# EAGLE design M837-pld-84 (EAGLE 6.6.0)
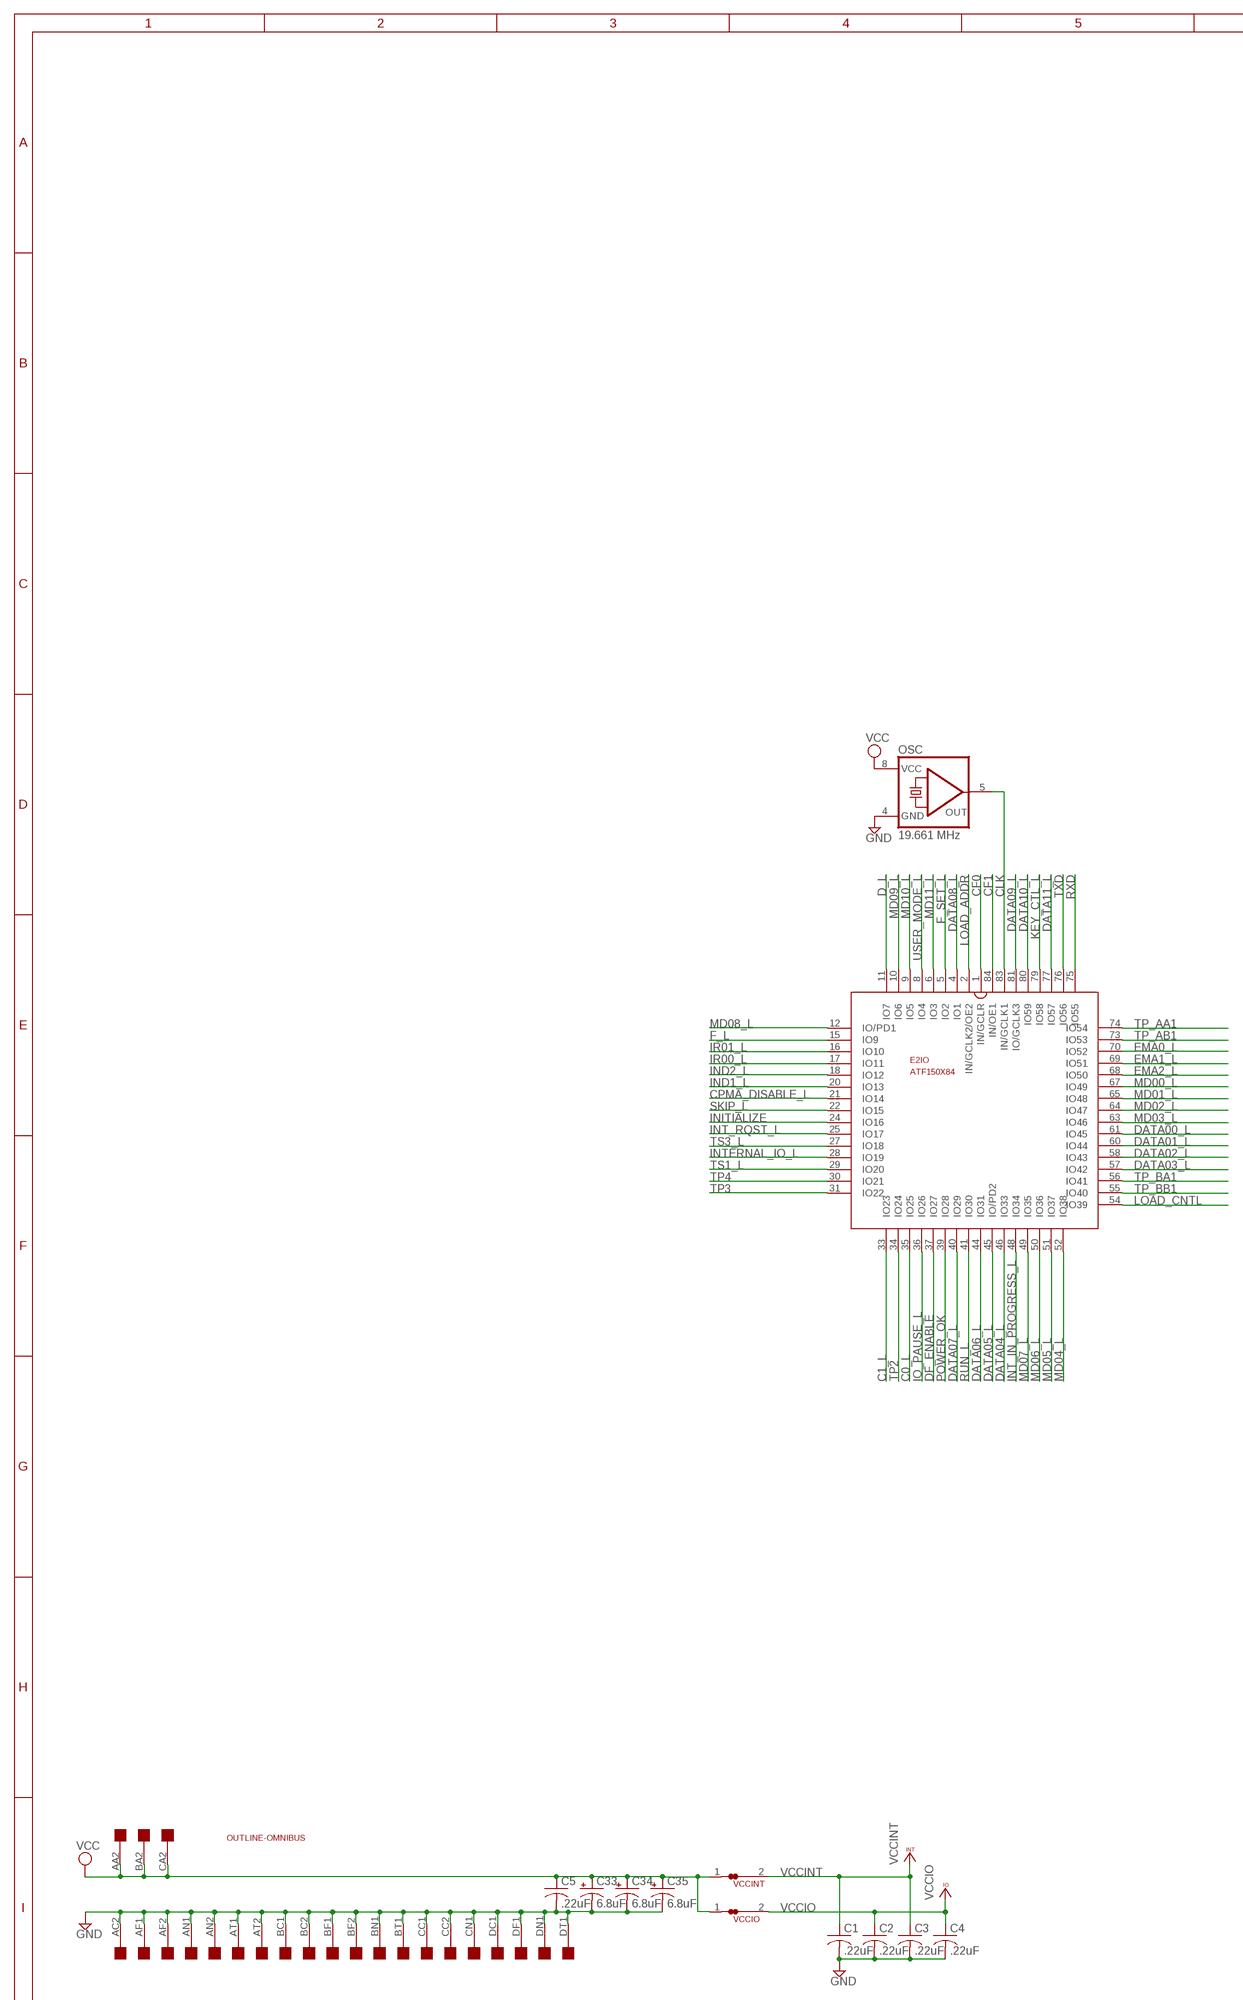
[diagram p0: schematic, sheet 1, part 1 of 2]
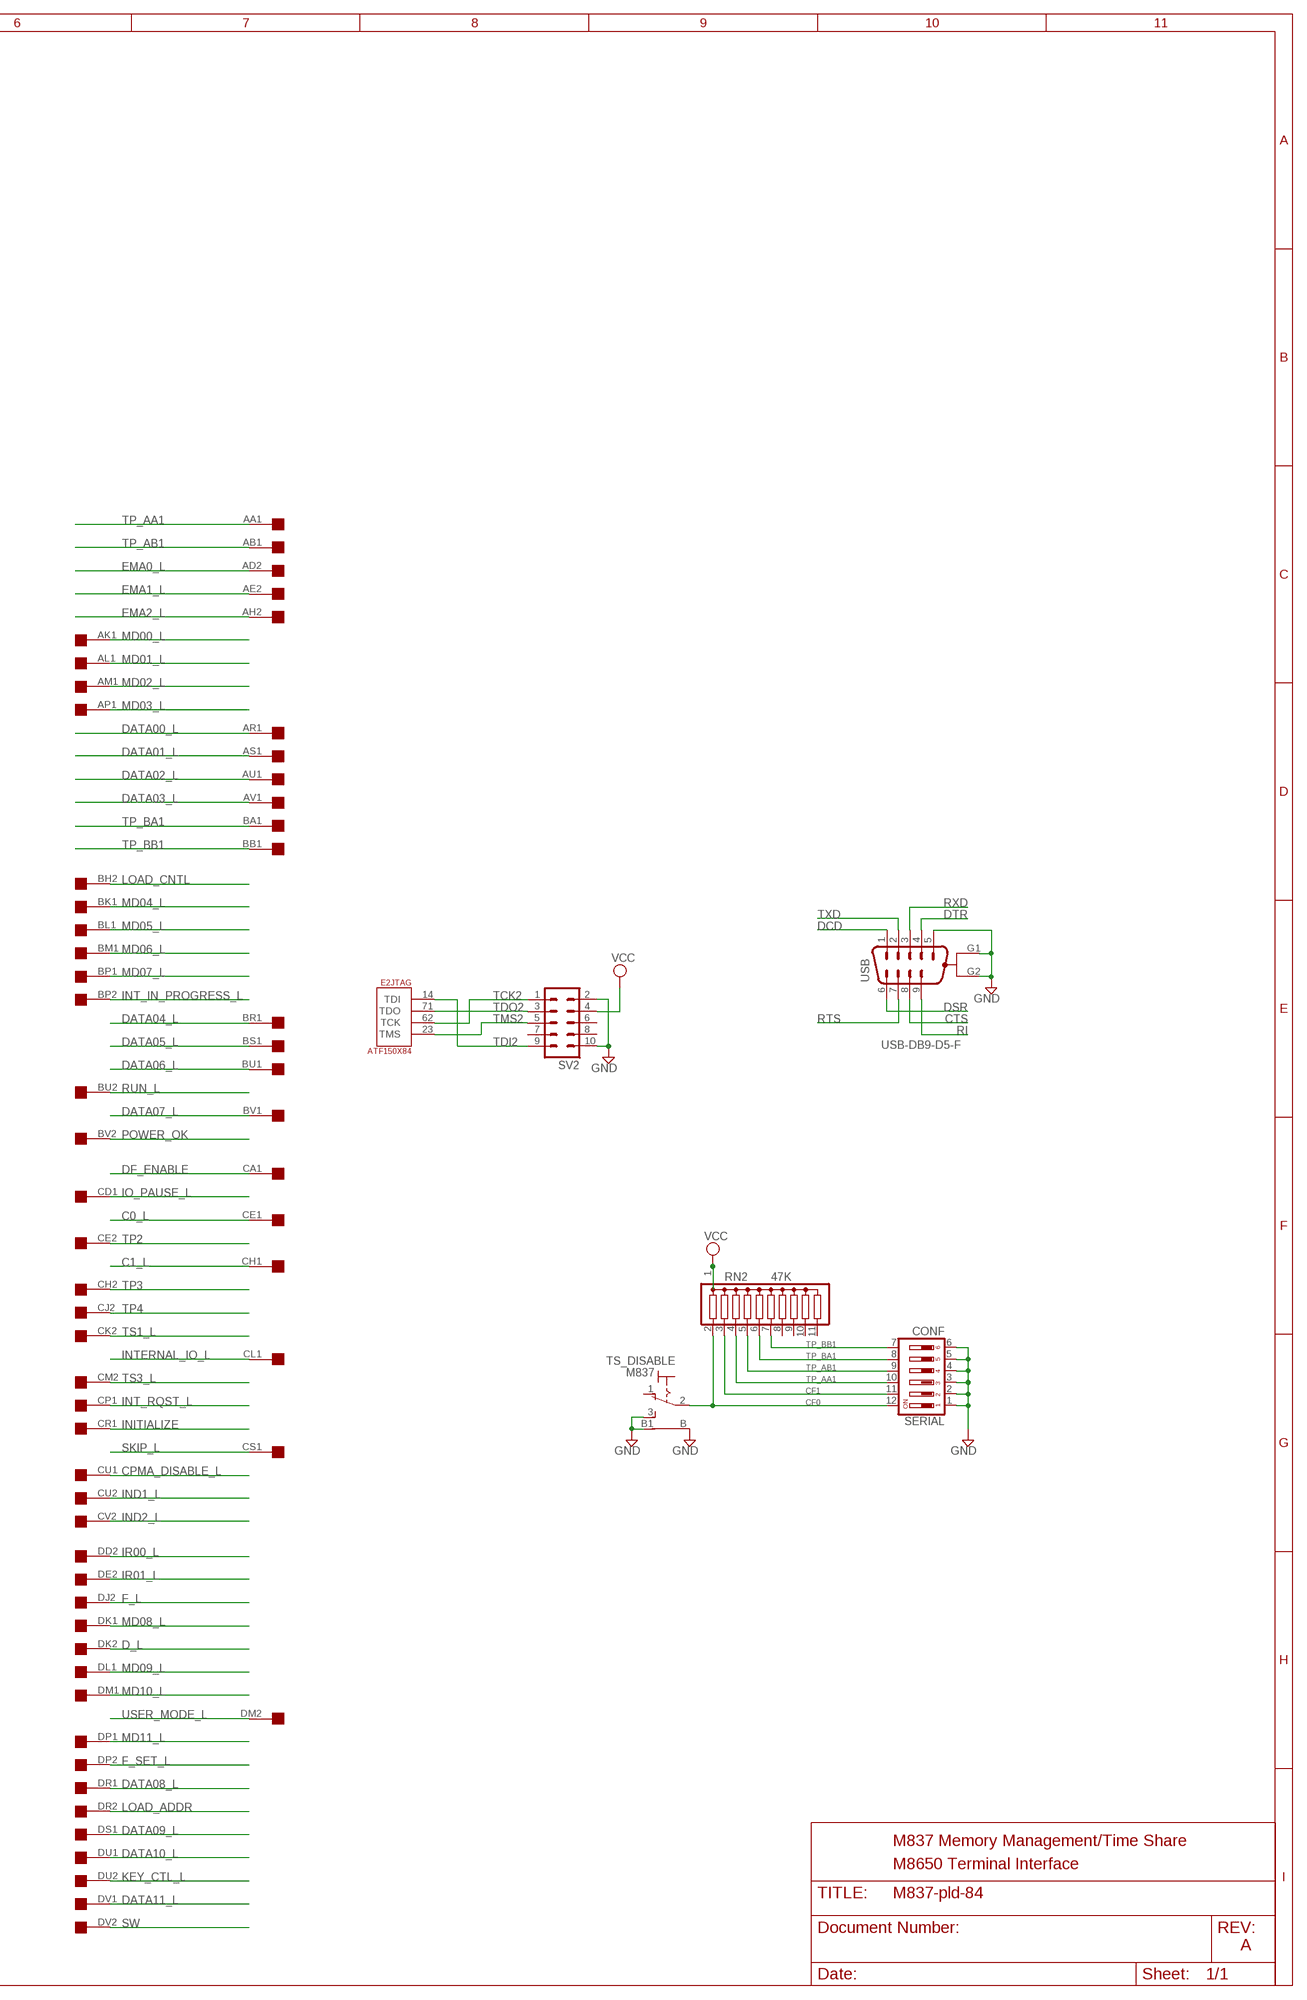
[diagram p1: schematic, sheet 1, part 2 of 2]

## Parts
C1  .22uF  C-US  [C063-025X075]
C2  .22uF  C-US  [C063-025X075]
C3  .22uF  C-US  [C063-025X075]
C4  .22uF  C-US  [C063-025X075]
C5  .22uF  C-US  [C063-025X075]
C33  6.8uF  CPOL-USE20-8AXIAL  [E12-8]
C34  6.8uF  CPOL-USE20-8AXIAL  [E12-8]
C35  6.8uF  CPOL-USE20-8AXIAL  [E12-8]
E2  ATF150X84  [S84]
OSC  19.661 MHz  QG5460  [DIL08S]
RN2  47K  G10R  [SIL11]
SERIAL  CONF  DP06  [DP-06]
SV2  ML10  [ML10]
TS_DISABLE  M837  9070-1W  [9070-1W]
U$1  QUAD  [EDGE-CON8]
U$2  OUTLINE-OMNIBUS  [OMNIBUS]
USB  USB-DB9-D5-F  DB9  [AMP_DB-9RA]
VCCINT  JUMPER-NC1  [NC1]
VCCIO  JUMPER-NC1  [NC1]

## Nets
C0_L: E2.35(IO:IO25) U$1.CE1
C1_L: E2.33(IO:IO23) U$1.CH1
CF0: E2.1(IO:IN/GCLR) RN2.2 SERIAL.12 TS_DISABLE.2(P)
CF1: E2.84(IO:IN/OE1) RN2.3 SERIAL.11
CLK: E2.83(IO:IN/GCLK1) OSC.5(OUT)
CPMA_DISABLE_L: E2.21(IO:IO14) U$1.CU1
CTS: USB.8
D_L: E2.11(IO:IO7) U$1.DK2
DATA00_L: E2.61(IO:IO45) U$1.AR1
DATA01_L: E2.60(IO:IO44) U$1.AS1
DATA02_L: E2.58(IO:IO43) U$1.AU1
DATA03_L: E2.57(IO:IO42) U$1.AV1
DATA04_L: E2.46(IO:IO33) U$1.BR1
DATA05_L: E2.45(IO:IO/PD2) U$1.BS1
DATA06_L: E2.44(IO:IO31) U$1.BU1
DATA07_L: E2.40(IO:IO29) U$1.BV1
DATA08_L: E2.4(IO:IO1) U$1.DR1
DATA09_L: E2.81(IO:IO/GCLK3) U$1.DS1
DATA10_L: E2.80(IO:IO59) U$1.DU1
DATA11_L: E2.77(IO:IO57) U$1.DV1
DCD: USB.1
DF_ENABLE: E2.37(IO:IO27) U$1.CA1
DSR: USB.6
DTR: USB.4
EMA0_L: E2.70(IO:IO52) U$1.AD2
EMA1_L: E2.69(IO:IO51) U$1.AE2
EMA2_L: E2.68(IO:IO50) U$1.AH2
F_L: E2.15(IO:IO9) U$1.DJ2
F_SET_L: E2.5(IO:IO2) U$1.DP2
GND [supply]: C1.2 C2.2 C3.2 C4.2 C5.2 C33.- C34.- C35.- OSC.4(GND) SERIAL.1 SERIAL.2 SERIAL.3 SERIAL.4 SERIAL.5 SERIAL.6 SV2.2 SV2.10 TS_DISABLE.3(S) TS_DISABLE.B TS_DISABLE.B1 U$1.AC2 U$1.AF1 U$1.AF2 U$1.AN1 U$1.AN2 U$1.AT1 U$1.AT2 U$1.BC1 U$1.BC2 U$1.BF1 U$1.BF2 U$1.BN1 U$1.BT1 U$1.CC1 U$1.CC2 U$1.CN1 U$1.DC1 U$1.DF1 U$1.DN1 U$1.DT1 USB.5 USB.G1 USB.G2
IND1_L: E2.20(IO:IO13) U$1.CU2
IND2_L: E2.18(IO:IO12) U$1.CV2
INITIALIZE: E2.24(IO:IO16) U$1.CR1
INT_IN_PROGRESS_L: E2.48(IO:IO34) U$1.BP2
INT_RQST_L: E2.25(IO:IO17) U$1.CP1
INTERNAL_IO_L: E2.28(IO:IO19) U$1.CL1
IO_PAUSE_L: E2.36(IO:IO26) U$1.CD1
IR00_L: E2.17(IO:IO11) U$1.DD2
IR01_L: E2.16(IO:IO10) U$1.DE2
KEY_CTL_L: E2.79(IO:IO58) U$1.DU2
LOAD_ADDR: E2.2(IO:IN/GCLK2/OE2) U$1.DR2
LOAD_CNTL: E2.54(IO:IO39) U$1.BH2
MD00_L: E2.67(IO:IO49) U$1.AK1
MD01_L: E2.65(IO:IO48) U$1.AL1
MD02_L: E2.64(IO:IO47) U$1.AM1
MD03_L: E2.63(IO:IO46) U$1.AP1
MD04_L: E2.52(IO:IO38) U$1.BK1
MD05_L: E2.51(IO:IO37) U$1.BL1
MD06_L: E2.50(IO:IO36) U$1.BM1
MD07_L: E2.49(IO:IO35) U$1.BP1
MD08_L: E2.12(IO:IO/PD1) U$1.DK1
MD09_L: E2.10(IO:IO6) U$1.DL1
MD10_L: E2.9(IO:IO5) U$1.DM1
MD11_L: E2.6(IO:IO3) U$1.DP1
POWER_OK: E2.39(IO:IO28) U$1.BV2
RI: USB.9
RTS: USB.7
RUN_L: E2.41(IO:IO30) U$1.BU2
RXD: E2.75(IO:IO55) USB.3
SKIP_L: E2.22(IO:IO15) U$1.CS1
SW: U$1.DV2
TCK2: E2.62(JTAG:TCK) SV2.1
TDI2: E2.14(JTAG:TDI) SV2.9
TDO2: E2.71(JTAG:TDO) SV2.3
TMS2: E2.23(JTAG:TMS) SV2.5
TP2: E2.34(IO:IO24) U$1.CE2
TP3: E2.31(IO:IO22) U$1.CH2
TP4: E2.30(IO:IO21) U$1.CJ2
TP_AA1: E2.74(IO:IO54) RN2.4 SERIAL.10 U$1.AA1
TP_AB1: E2.73(IO:IO53) RN2.5 SERIAL.9 U$1.AB1
TP_BA1: E2.56(IO:IO41) RN2.6 SERIAL.8 U$1.BA1
TP_BB1: E2.55(IO:IO40) RN2.7 SERIAL.7 U$1.BB1
TS1_L: E2.29(IO:IO20) U$1.CK2
TS3_L: E2.27(IO:IO18) U$1.CM2
TXD: E2.76(IO:IO56) USB.2
USER_MODE_L: E2.8(IO:IO4) U$1.DM2
VCC [supply]: C5.1 C33.+ C34.+ C35.+ OSC.8(VCC) RN2.1 SV2.4 U$1.AA2 U$1.BA2 U$1.CA2 VCCINT.1 VCCIO.1
VCCINT [supply]: C1.1 C3.1 VCCINT.2
VCCIO [supply]: C2.1 C4.1 VCCIO.2
Unconnected: RN2.8 RN2.9 RN2.10 RN2.11 SV2.6 SV2.7 SV2.8 TS_DISABLE.1(O) U$1.AB2 U$1.AC1 U$1.AD1 U$1.AE1 U$1.AH1 U$1.AJ1 U$1.AJ2 U$1.AK2 U$1.AL2 U$1.AM2 U$1.AP2 U$1.AR2 U$1.AS2 U$1.AU2 U$1.AV2 U$1.BB2 U$1.BD1 U$1.BD2 U$1.BE1 U$1.BE2 U$1.BH1 U$1.BJ1 U$1.BJ2 U$1.BK2 U$1.BL2 U$1.BM2 U$1.BN2 U$1.BR2 U$1.BS2 U$1.BT2 U$1.CB1 U$1.CB2 U$1.CD2 U$1.CF1 U$1.CF2 U$1.CJ1 U$1.CK1 U$1.CL2 U$1.CM1 U$1.CN2 U$1.CP2 U$1.CR2 U$1.CS2 U$1.CT1 U$1.CT2 U$1.CV1 U$1.DA1 U$1.DA2 U$1.DB1 U$1.DB2 U$1.DC2 U$1.DD1 U$1.DE1 U$1.DF2 U$1.DH1 U$1.DH2 U$1.DJ1 U$1.DL2 U$1.DN2 U$1.DS2 U$1.DT2

## Notes on the sheet
- M837 Memory Management/Time Share
- M8650 Terminal Interface
- A

## Power pins joined to a net without a drawn wire
GND: E2.7(GND) E2.19(GND) E2.32(GND) E2.42(GND) E2.47(GND) E2.59(GND) E2.72(GND) E2.82(GND)
VCCINT: E2.3(VCCINT) E2.43(VCCINT)
VCCIO: E2.13(VCCIO) E2.26(VCCIO) E2.38(VCCIO) E2.53(VCCIO) E2.66(VCCIO) E2.78(VCCIO)

## Library data of the parts
C1-C5 = dec-con:C-US: Capacitors with funky DEC lead spacing.
C33-C35 = dec-con:CPOL-USE20-8AXIAL: A 0.8 inch electrolytic.
E2 = atmel-cpld:ATF150X84: ATF150x in 84 pin package.
OSC = crystal:QG5460: CRYSTAL RESONATOR; OC_FARNELL: unknown; OC_NEWARK: unknown
RN2 = resistor-sil:G10R: SIL RESISTOR; OC_FARNELL: unknown; OC_NEWARK: unknown
SERIAL = switch-dil:DP06: DIL/CODE SWITCH; MPN: MCDP06; OC_FARNELL: 9471618; OC_NEWARK: 26M1097
SV2 = con-harting-ml:ML10: HARTING; OC_FARNELL: unknown; OC_NEWARK: unknown
TS_DISABLE = switch:9070-1W: TOGGLE SWITCH Marquardt
U$1 = dec-con:QUAD: Quad-Height DEC board
U$2 = dec-con:OUTLINE-*: Board outlines for DEC boards.
USB = alan_common:DB9; MANF: TE/AMP; MANF#: 1734352-1; MOUSER#: 571-1734352-1
VCCINT VCCIO = dec-con:JUMPER: Normally closed SMD Jumper (Generates a DRC error.)

## Net classes
1 supply: width 0.381 mm

## Board
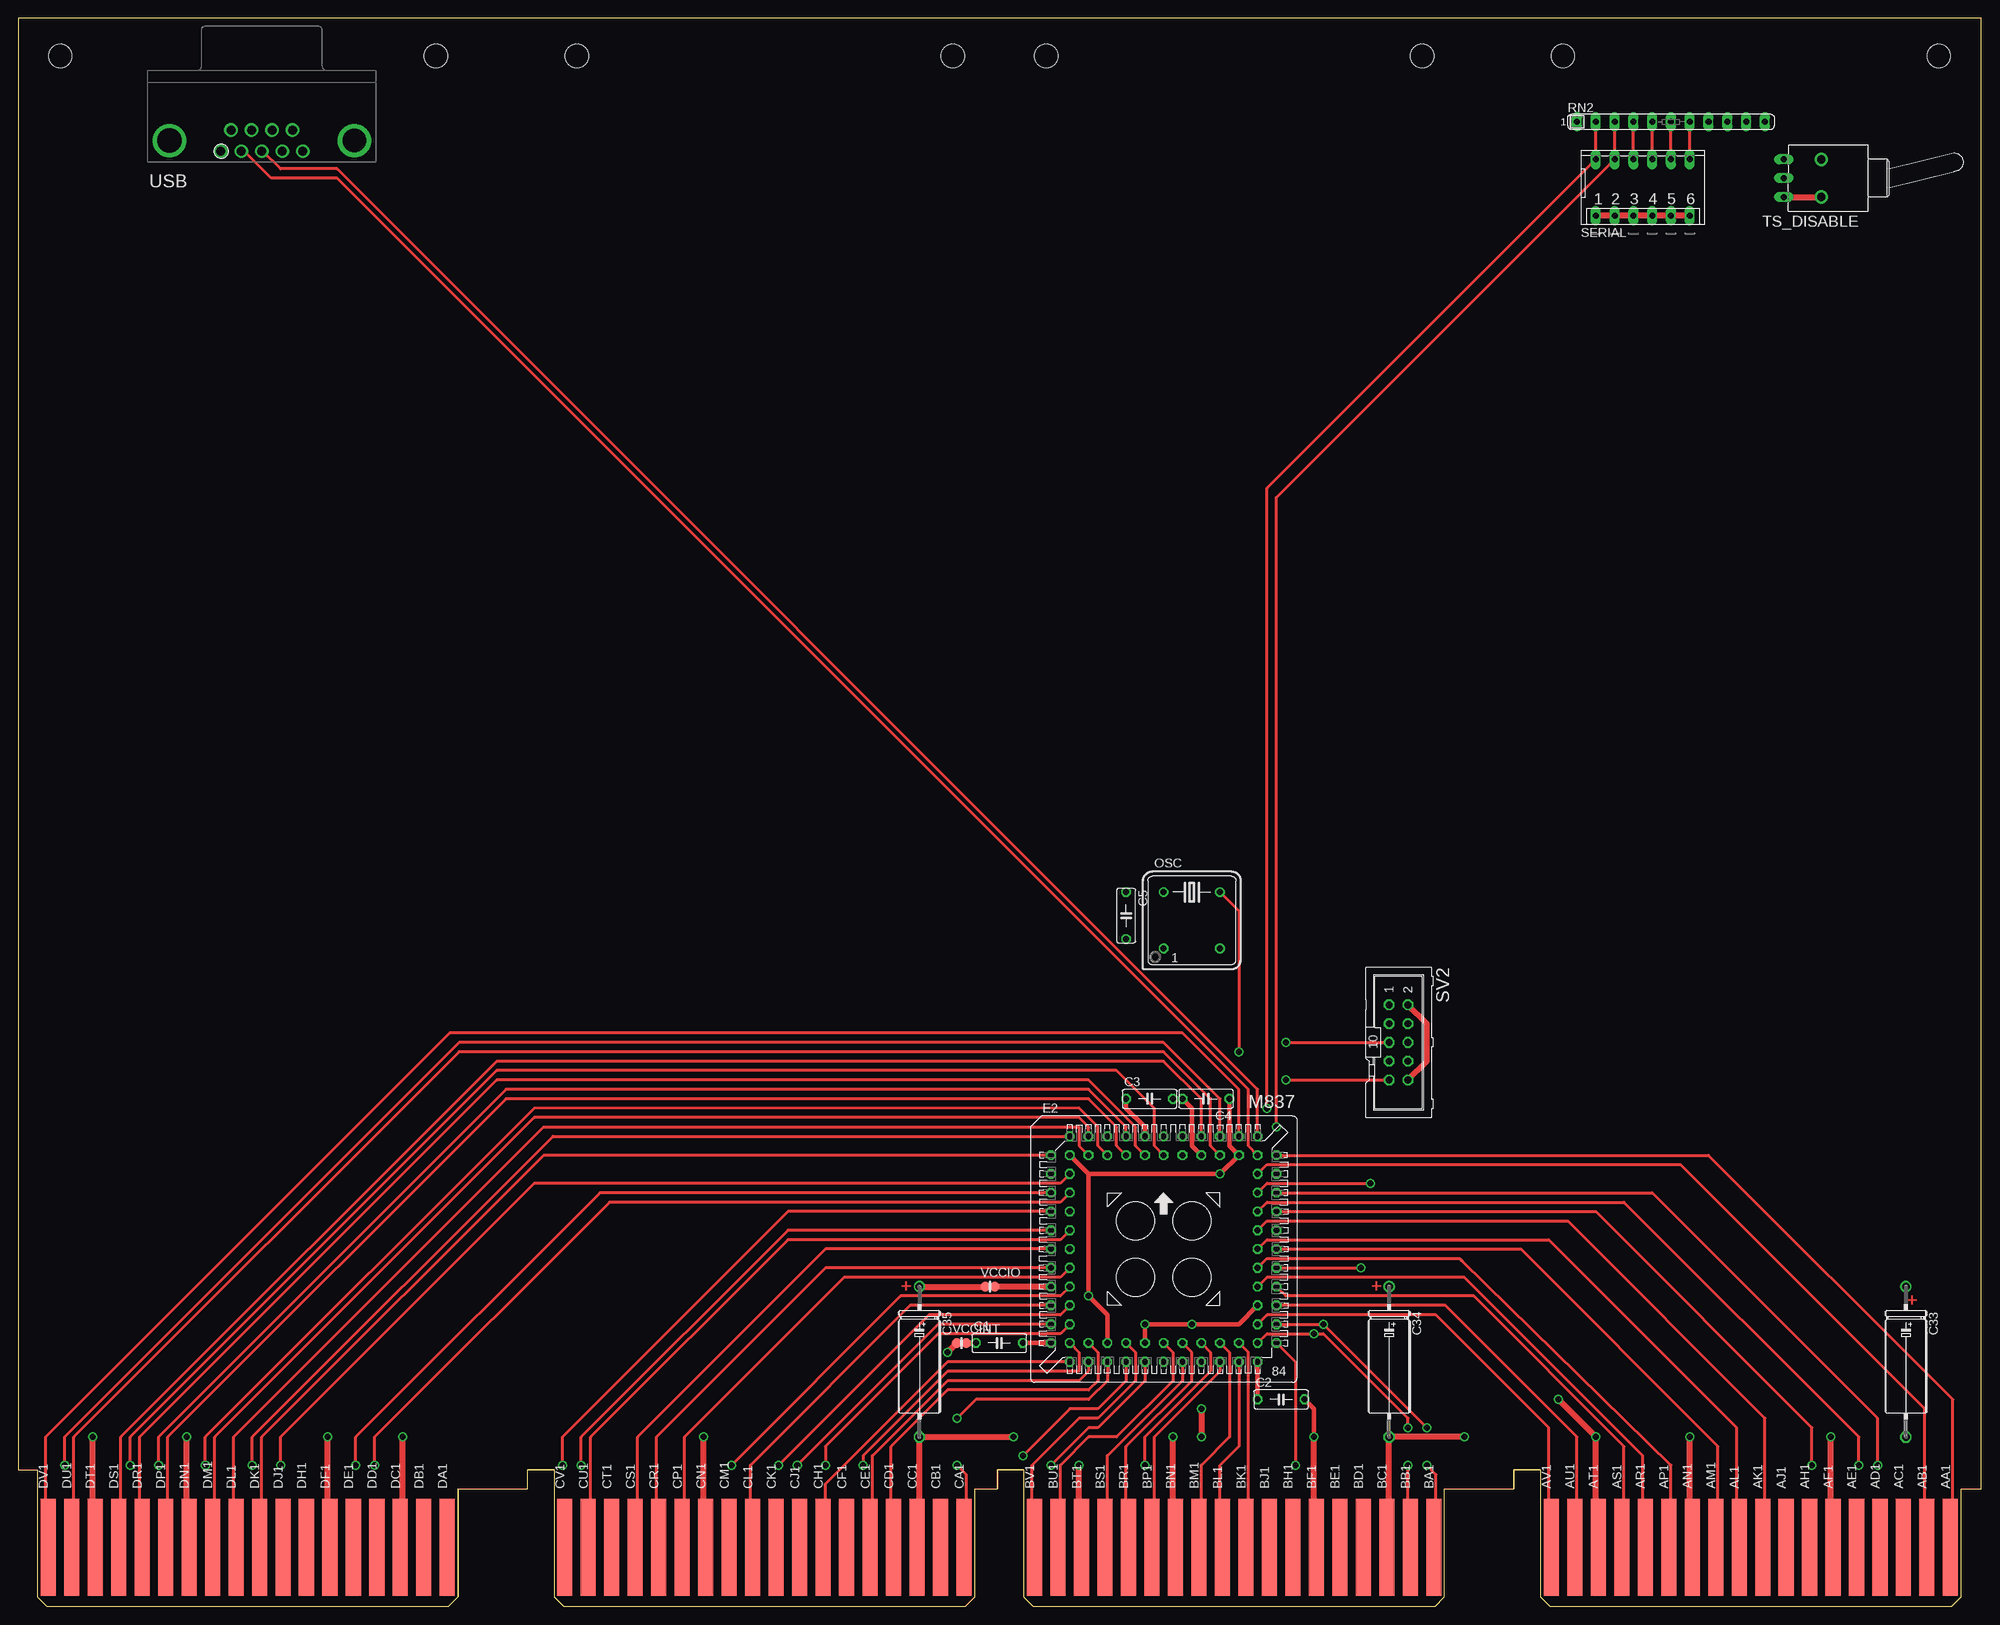
[diagram p2: board, top side]
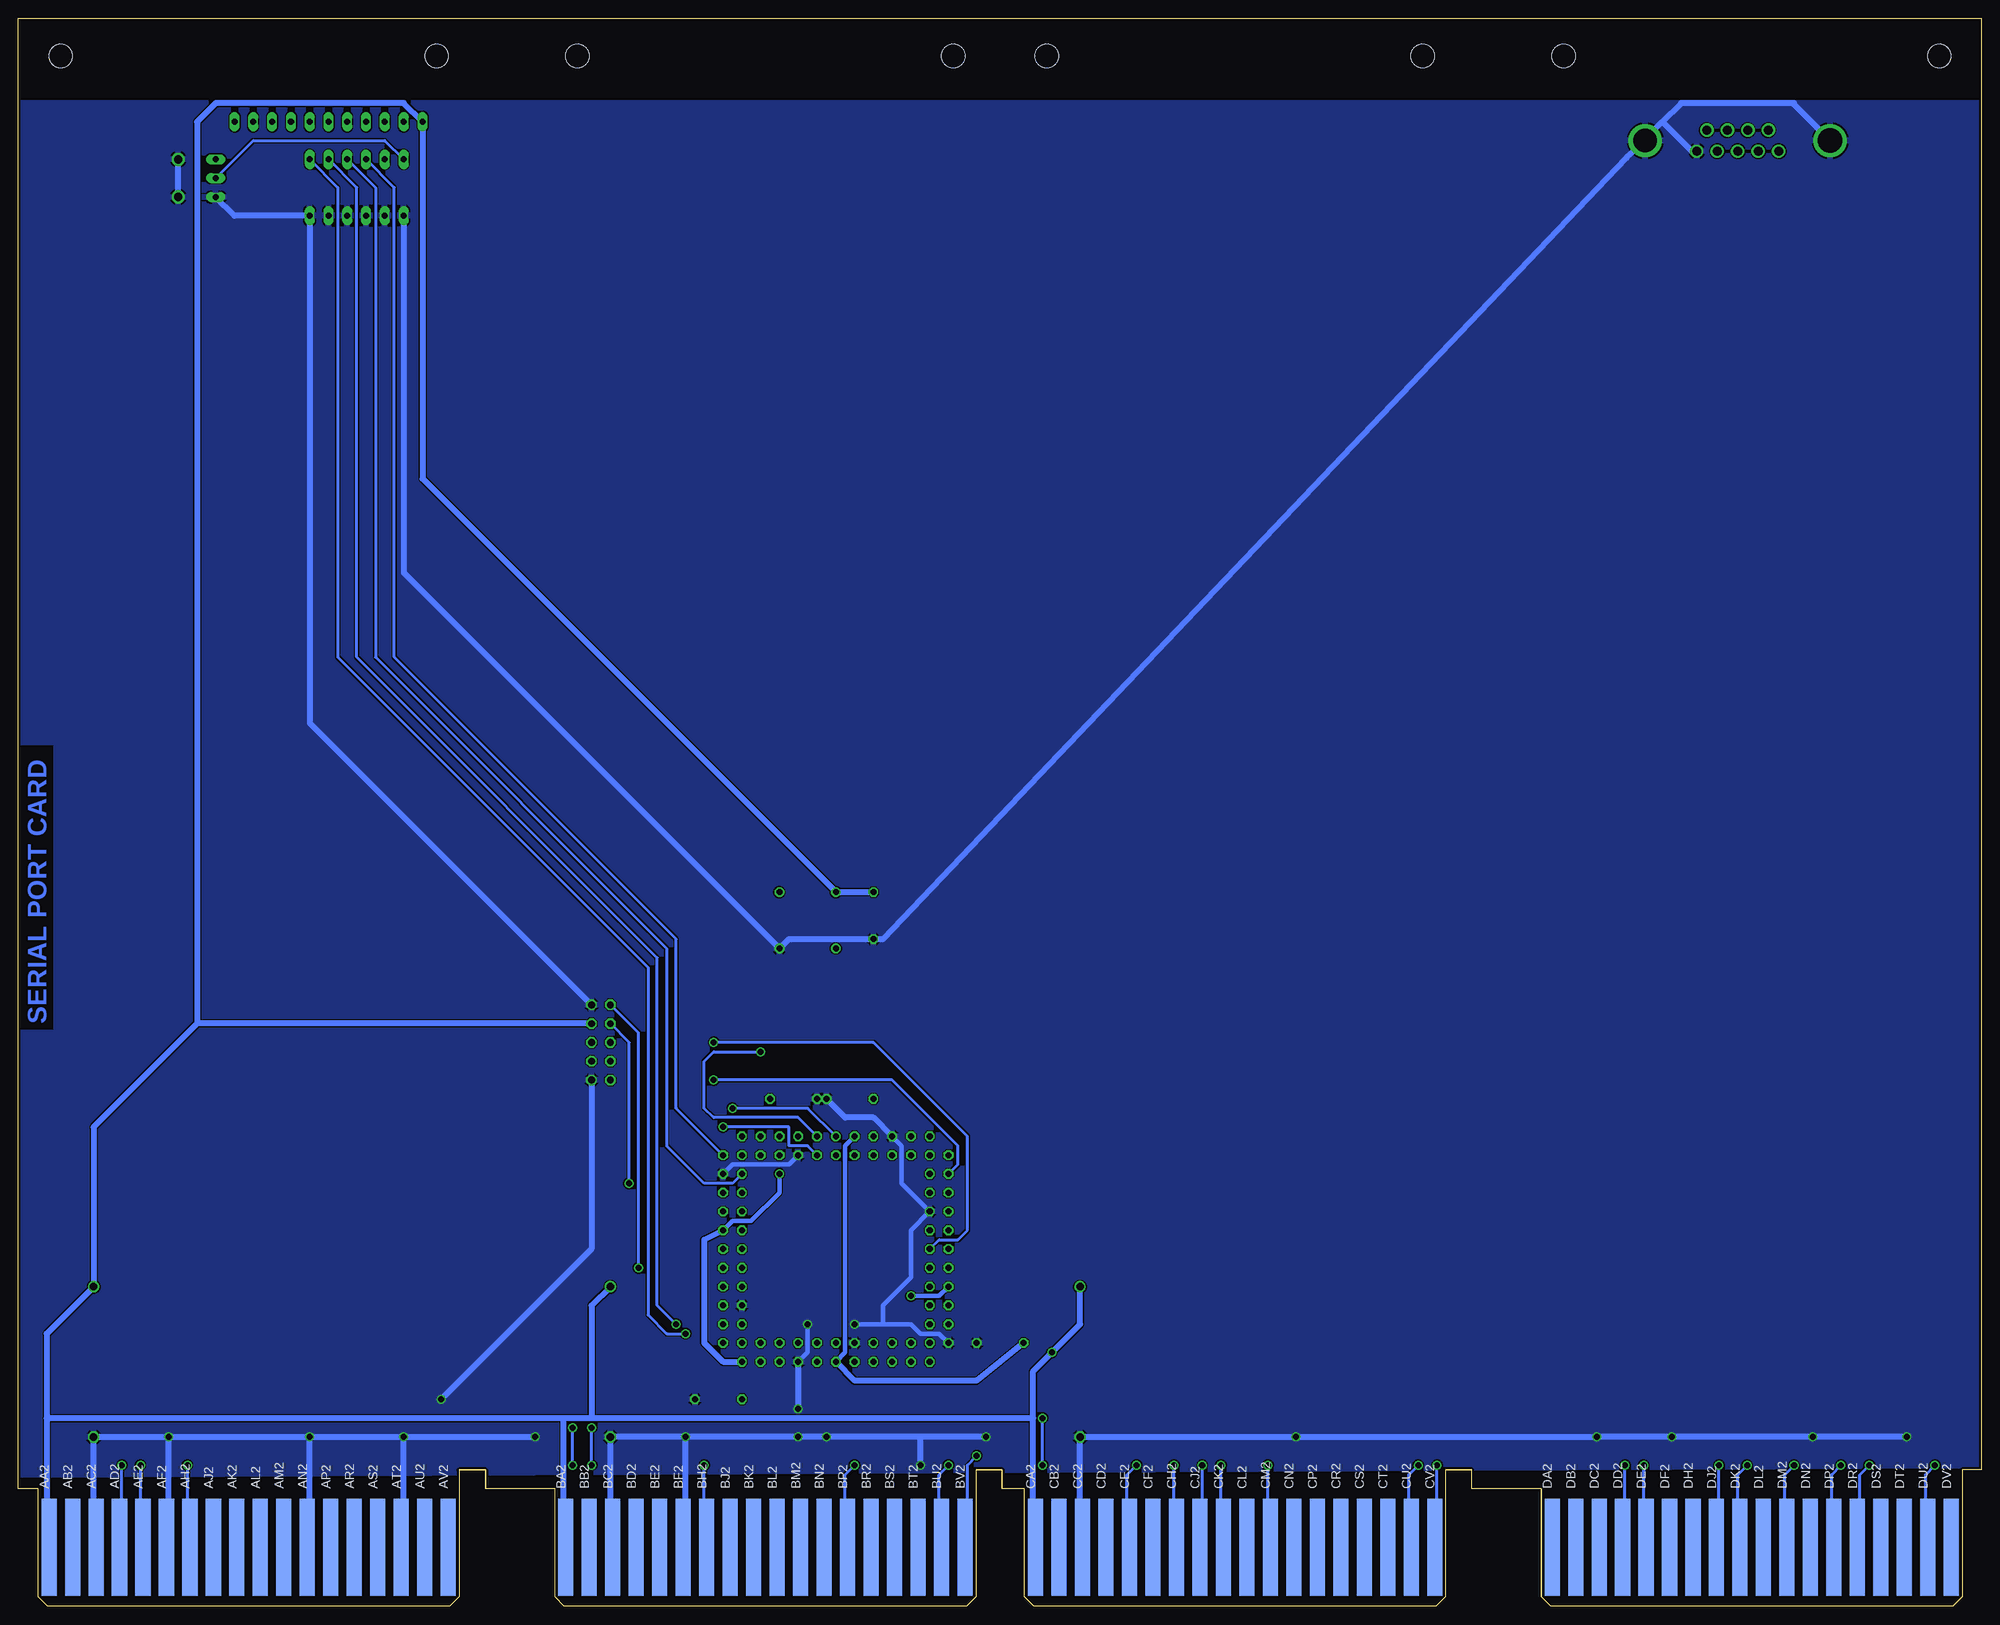
[diagram p3: board, bottom side, seen from below]

Size 265.3 x 214.63 mm. Coordinates in mm from the lower left corner, seen from the top.
Copper layers (1+16): Top 0.035mm / dielectric 1.5mm / Bottom 0.035mm
Design rules "16mils *": minimum track width 16mil, minimum drill 32mil, track to track 7mil, track to pad 8mil, pad to pad 8mil, via to via 10mil, smd to smd 7mil, copper to edge 13mil, drill to drill 10mil, minimum pad ring 10mil, minimum via ring 8mil, stop-mask expansion 0mil, vias tented up to drill 0mil, thermal gap 10mil

### Footprints (pad centres in the part's own frame; a part is rotated, then mirrored left to right if it is on the bottom)
C063-025X075 = drill 0.813 octagon: 1 -2.54,0; 2 3.81,0
E12-8 = drill 1.016: + -10.16,0 | drill 1.016 octagon: - 10.16,0
S84 = drill 0.813: 1 0,15.24 | drill 0.813 octagon: 2 0,12.7; 3 -2.54,15.24; 4 -2.54,12.7; 5 -5.08,15.24; 6 -5.08,12.7; 7 -7.62,15.24; 8 -7.62,12.7; 9 -10.16,15.24; 10 -10.16,12.7; 11 -12.7,15.24; 12 -15.24,12.7; 13 -12.7,12.7; 14 -15.24,10.16; 15 -12.7,10.16; 16 -15.24,7.62; 17 -12.7,7.62; 18 -15.24,5.08; 19 -12.7,5.08; 20 -15.24,2.54; 21 -12.7,2.54; 22 -15.24,0; 23 -12.7,0; 24 -15.24,-2.54; 25 -12.7,-2.54; 26 -15.24,-5.08; 27 -12.7,-5.08; 28 -15.24,-7.62; 29 -12.7,-7.62; 30 -15.24,-10.16; 31 -12.7,-10.16; 32 -15.24,-12.7; 33 -12.7,-15.24; 34 -12.7,-12.7; 35 -10.16,-15.24; 36 -10.16,-12.7; 37 -7.62,-15.24; 38 -7.62,-12.7; 39 -5.08,-15.24; 40 -5.08,-12.7; 41 -2.54,-15.24; 42 -2.54,-12.7; 43 0,-15.24; 44 0,-12.7; 45 2.54,-15.24; 46 2.54,-12.7; 47 5.08,-15.24; 48 5.08,-12.7; 49 7.62,-15.24; 50 7.62,-12.7; 51 10.16,-15.24; 52 10.16,-12.7; 53 12.7,-15.24; 54 15.24,-12.7; 55 12.7,-12.7; 56 15.24,-10.16; 57 12.7,-10.16; 58 15.24,-7.62; 59 12.7,-7.62; 60 15.24,-5.08; 61 12.7,-5.08; 62 15.24,-2.54; 63 12.7,-2.54; 64 15.24,0; 65 12.7,0; 66 15.24,2.54; 67 12.7,2.54; 68 15.24,5.08; 69 12.7,5.08; 70 15.24,7.62; 71 12.7,7.62; 72 15.24,10.16; 73 12.7,10.16; 74 15.24,12.7; 75 12.7,15.24; 76 12.7,12.7; 77 10.16,15.24; 78 10.16,12.7; 79 7.62,15.24; 80 7.62,12.7; 81 5.08,15.24; 82 5.08,12.7; 83 2.54,15.24; 84 2.54,12.7
DIL08S = drill 0.813: 1 -3.81,-3.81; 4 3.81,-3.81; 5 3.81,3.81; 8 -3.81,3.81
SIL11 = drill 0.813 long: 1 -12.7,0; 2 -10.16,0; 3 -7.62,0; 4 -5.08,0; 5 -2.54,0; 6 0,0; 7 2.54,0; 8 5.08,0; 9 7.62,0; 10 10.16,0; 11 12.7,0
DP-06 = drill 0.813 long: 1 -6.35,-3.81; 2 -3.81,-3.81; 3 -1.27,-3.81; 4 1.27,-3.81; 5 3.81,-3.81; 6 6.35,-3.81; 7 6.35,3.81; 8 3.81,3.81; 9 1.27,3.81; 10 -1.27,3.81; 11 -3.81,3.81; 12 -6.35,3.81
ML10 = drill 0.914 octagon: 1 -5.08,-1.27; 2 -5.08,1.27; 3 -2.54,-1.27; 4 -2.54,1.27; 5 0,-1.27; 6 0,1.27; 7 2.54,-1.27; 8 2.54,1.27; 9 5.08,-1.27; 10 5.08,1.27
9070-1W = drill 0.813 long: 1 5.08,-2.54; 2 5.08,0; 3 5.08,2.54 | drill 1.118 pad 1.778: B 0,-2.54; B1 0,2.54
EDGE-CON8 = smd 2.032 x 13.106: AA1 261.303,7.938; AB1 258.127,7.938; AC1 254.952,7.938; AD1 251.778,7.938; AE1 248.602,7.938; AF1 245.428,7.938; AH1 242.252,7.938; AJ1 239.077,7.938; AK1 235.903,7.938; AL1 232.727,7.938; AM1 229.553,7.938; AN1 226.377,7.938; AP1 223.202,7.938; AR1 220.028,7.938; AS1 216.852,7.938; AT1 213.678,7.938; AU1 210.502,7.938; AV1 207.327,7.938; BA1 191.452,7.938; BB1 188.278,7.938; BC1 185.102,7.938; BD1 181.928,7.938; BE1 178.752,7.938; BF1 175.577,7.938; BH1 172.403,7.938; BJ1 169.227,7.938; BK1 166.053,7.938; BL1 162.877,7.938; BM1 159.702,7.938; BN1 156.528,7.938; BP1 153.352,7.938; BR1 150.178,7.938; BS1 147.002,7.938; BT1 143.827,7.938; BU1 140.653,7.938; BV1 137.477,7.938; CA1 127.953,7.938; CB1 124.778,7.938; CC1 121.603,7.938; CD1 118.427,7.938; CE1 115.252,7.938; CF1 112.078,7.938; CH1 108.903,7.938; CJ1 105.728,7.938; CK1 102.552,7.938; CL1 99.377,7.938; CM1 96.203,7.938; CN1 93.028,7.938; CP1 89.853,7.938; CR1 86.677,7.938; CS1 83.502,7.938; CT1 80.328,7.938; CU1 77.153,7.938; CV1 73.978,7.938; DA1 58.102,7.938; DB1 54.928,7.938; DC1 51.752,7.938; DD1 48.578,7.938; DE1 45.403,7.938; DF1 42.227,7.938; DH1 39.053,7.938; DJ1 35.877,7.938; DK1 32.703,7.938; DL1 29.527,7.938; DM1 26.352,7.938; DN1 23.177,7.938; DP1 20.003,7.938; DR1 16.828,7.938; DS1 13.652,7.938; DT1 10.477,7.938; DU1 7.303,7.938; DV1 4.128,7.938 | smd 2.032 x 13.106 bottom: AA2 261.303,7.938; AB2 258.127,7.938; AC2 254.952,7.938; AD2 251.778,7.938; AE2 248.602,7.938; AF2 245.428,7.938; AH2 242.252,7.938; AJ2 239.077,7.938; AK2 235.903,7.938; AL2 232.727,7.938; AM2 229.553,7.938; AN2 226.377,7.938; AP2 223.202,7.938; AR2 220.028,7.938; AS2 216.852,7.938; AT2 213.678,7.938; AU2 210.502,7.938; AV2 207.327,7.938; BA2 191.452,7.938; BB2 188.278,7.938; BC2 185.102,7.938; BD2 181.928,7.938; BE2 178.752,7.938; BF2 175.577,7.938; BH2 172.403,7.938; BJ2 169.227,7.938; BK2 166.053,7.938; BL2 162.877,7.938; BM2 159.702,7.938; BN2 156.528,7.938; BP2 153.352,7.938; BR2 150.178,7.938; BS2 147.002,7.938; BT2 143.827,7.938; BU2 140.653,7.938; BV2 137.477,7.938; CA2 127.953,7.938; CB2 124.778,7.938; CC2 121.603,7.938; CD2 118.427,7.938; CE2 115.252,7.938; CF2 112.078,7.938; CH2 108.903,7.938; CJ2 105.728,7.938; CK2 102.552,7.938; CL2 99.377,7.938; CM2 96.203,7.938; CN2 93.028,7.938; CP2 89.853,7.938; CR2 86.677,7.938; CS2 83.502,7.938; CT2 80.328,7.938; CU2 77.153,7.938; CV2 73.978,7.938; DA2 58.102,7.938; DB2 54.928,7.938; DC2 51.752,7.938; DD2 48.578,7.938; DE2 45.403,7.938; DF2 42.227,7.938; DH2 39.053,7.938; DJ2 35.877,7.938; DK2 32.703,7.938; DL2 29.527,7.938; DM2 26.352,7.938; DN2 23.177,7.938; DP2 20.003,7.938; DR2 16.828,7.938; DS2 13.652,7.938; DT2 10.477,7.938; DU2 7.303,7.938; DV2 4.128,7.938
OMNIBUS = hole 3.175: 208.915,209.55; 259.715,209.55; 189.865,209.55; 139.065,209.55; 75.616,209.55; 126.416,209.55; 56.566,209.55; 5.766,209.55
AMP_DB-9RA = drill 1.2: 1 -5.54,-1.42; 2 -2.77,-1.42; 3 0,-1.42; 4 2.77,-1.42; 5 5.54,-1.42; 6 -4.155,1.42; 7 -1.385,1.42; 8 1.385,1.42; 9 4.155,1.42 | drill 3.302 pad 4.5: G1 -12.5,0 | drill 3.18 pad 4.5: G2 12.5,0
NC1 = smd 1.346 x 1.346: 1 -0.635,0; 2 0.635,0

### Placement (x,y rotation side)
C1  131.95,35.56 0 top
C2  170.05,27.94 0 top
C3  152.27,68.58 0 top
C4  161.16,68.58 180 top
C5  149.73,93.98 270 top
C33  255.14,33.02 270 top
C34  185.29,33.02 270 top
C35  121.79,33.02 270 top
E2  154.81,48.26 0 top
OSC  158.62,92.71 0 top
RN2  223.39,200.66 0 top
SERIAL  219.58,191.77 0 top
SV2  186.56,76.2 270 top
TS_DISABLE  243.71,193.04 180 top
U$1  -0.13,0 0 top
U$2  -0.13,0 0 top
USB  32.89,198.12 0 top
VCCINT  127.51,35.56 0 top
VCCIO  131.32,43.18 0 top

### Tracks (layer width: path | path; a pad name or v marks a point on that pad's centre or on a via)
C0_L
  Top 0.406: E2.35 144.65,31.75 143.38,30.48 125.6,30.48 115.44,20.32 115.44,8.89 115.12,8.57 U$1.CE1
C1_L
  Top 0.406: U$1.CH1 108.78,8.57 109.09,8.89 109.09,16.51 125.6,33.02 E2.33
CF0  (via drill 0.81)
  Top 0.406: RN2.2 SERIAL.12 168.78,151.13 v168.78,67.31
  Bottom 0.406: E2.1 158.62,67.31 v168.78,67.31 | TS_DISABLE.2 233.55,198.12 215.77,198.12 SERIAL.12
CF1  (via drill 0.81)
  Top 0.406: RN2.3 SERIAL.11 170.05,149.86 v170.05,64.77
  Bottom 0.406: E2.84 158.62,62.23 161.16,62.23 161.16,64.77 v170.05,64.77
CLK  (via drill 0.81)
  Top 0.406: OSC.5 164.97,93.98 v164.97,74.93
  Bottom 0.406: v164.97,74.93 171.32,74.93 172.59,73.66 172.59,67.31 171.32,66.04 159.89,66.04 E2.83
CPMA_DISABLE_L
  Top 0.406: U$1.CU1 77.03,9.84 77.34,10.16 77.34,22.86 104.01,49.53 140.84,49.53 E2.21
D_L  (via drill 0.81)
  Top 0.406: v31.62,19.05 31.62,22.86 72.26,63.5 E2.11
  Bottom 0.406: U$1.DK2 32.58,8.57 32.89,8.89 32.89,17.78 v31.62,19.05
DATA00_L
  Top 0.406: U$1.AR1 219.9,8.57 219.58,8.89 219.58,20.32 195.45,44.45 168.78,44.45 E2.61
DATA01_L
  Top 0.406: U$1.AS1 216.72,8.57 217.04,8.89 217.04,21.59 196.72,41.91 171.32,41.91 E2.60
DATA02_L
  Top 0.406: U$1.AU1 210.69,7.94 210.69,22.86 192.91,40.64 E2.58
DATA03_L
  Top 0.406: U$1.AV1 207.2,8.57 206.88,8.89 206.88,24.13 191.64,39.37 168.78,39.37 E2.57
DATA04_L
  Top 0.406: U$1.BR1 150.05,8.57 149.73,8.89 149.73,21.59 158.62,30.48 158.62,34.29 E2.46
DATA05_L
  Top 0.406: U$1.BS1 146.88,9.84 147.19,10.16 147.19,20.32 157.35,30.48 E2.45
DATA06_L
  Top 0.406: U$1.BU1 140.53,8.57 140.84,8.89 140.84,19.05 144.65,22.86 148.46,22.86 156.08,30.48 156.08,34.29 E2.44
DATA07_L
  Top 0.406: U$1.BV1 137.35,8.57 137.03,8.89 137.03,19.05 143.38,25.4 145.92,25.4 151,30.48 151,34.29 E2.40
DATA08_L
  Top 0.406: U$1.DR1 16.38,7.62 16.38,22.86 64.64,71.12 144.65,71.12 151,64.77 151,62.23 E2.4
DATA09_L
  Top 0.406: U$1.DS1 13.52,8.57 13.84,8.89 13.84,22.86 64.64,73.66 154.81,73.66 159.89,68.58 E2.81
DATA10_L
  Top 0.406: U$1.DU1 7.18,8.57 7.49,8.89 7.49,22.86 59.56,74.93 154.81,74.93 161.16,68.58 161.16,62.23 E2.80
DATA11_L
  Top 0.406: U$1.DV1 3.68,7.94 3.68,22.86 58.29,77.47 157.35,77.47 164.97,69.85 E2.77
DF_ENABLE  (via drill 0.81)
  Top 0.406: U$1.CA1 127.83,8.57 128.14,8.89 128.14,17.78 v126.87,19.05 | E2.37 147.19,30.48 144.65,27.94 129.41,27.94 v126.87,25.4
  Bottom 0.406: v126.87,19.05 v126.87,25.4
EMA0_L  (via drill 0.81)
  Top 0.406: v251.33,19.05 251.33,25.4 220.85,55.88 E2.70
  Bottom 0.406: U$1.AD2 251.65,8.57 251.33,8.89 v251.33,19.05
EMA1_L  (via drill 0.81)
  Top 0.406: v248.79,19.05 248.79,22.86 217.04,54.61 168.78,54.61 E2.69
  Bottom 0.406: U$1.AE2 248.47,9.84 248.79,10.16 v248.79,19.05
EMA2_L  (via drill 0.81)
  Top 0.406: v242.44,19.05 242.44,24.13 213.23,53.34 E2.68
  Bottom 0.406: U$1.AH2 242.12,8.57 242.44,8.89 v242.44,19.05
F_L  (via drill 0.81)
  Top 0.406: v35.43,19.05 35.43,22.86 69.72,57.15 140.84,57.15 E2.15
  Bottom 0.406: U$1.DJ2 35.43,8.89 v35.43,19.05
F_SET_L  (via drill 0.81)
  Top 0.406: v18.92,19.05 18.92,22.86 65.91,69.85 144.65,69.85 149.73,64.77 E2.5
  Bottom 0.406: U$1.DP2 19.88,8.57 20.19,8.89 20.19,17.78 v18.92,19.05
GND  (via drill 0.81, 0.81 pad 0.3)
  Top 0.61: E2.82 158.62,62.23 158.62,67.31 C4.2 | C2.2 175.13,26.67 v175.13,22.86 | E2.59 164.97,38.1 v158.62,38.1 v152.27,38.1 E2.42 | C1.2 E2.32
  Top 0.813: U$1.DT1 10.03,8.89 v10.03,22.86 | v195.45,22.86 C34.- 185.29,8.89 U$1.BC2 | U$1.DN1 22.73,7.62 v22.73,22.86 | U$1.DF1 41.78,8.89 v41.78,22.86 | U$1.DC1 51.94,8.89 v51.94,22.86 | v134.49,22.86 C35.- 121.79,8.89 U$1.CC2 | U$1.CN1 92.58,8.89 v92.58,22.86 | U$1.BF2 175.13,8.89 v175.13,22.86 | U$1.BN1 156.08,8.89 v156.08,22.86 | U$1.BT1 143.38,8.89 v143.38,19.05 | U$1.AT1 213.55,8.57 213.23,8.89 v213.23,22.86 v208.15,27.94 | U$1.AN1 226.25,8.57 225.93,8.89 v225.93,22.86 | U$1.AF1 245.3,8.57 244.98,8.89 v244.98,22.86 | SV2.10 190.37,73.66 190.37,78.74 SV2.2 | v159.89,26.67 v159.89,22.86 | C3.2 C4.2 | SERIAL.6 SERIAL.5 SERIAL.4 SERIAL.3 SERIAL.2 SERIAL.1 | TS_DISABLE.3 TS_DISABLE.B1
  Bottom 0.61: E2.7 145.92,62.23 145.92,57.15 E2.19 144.65,50.8 144.65,44.45 148.46,40.64 148.46,38.1 | E2.47 158.62,34.29 v158.62,38.1 | E2.32 140.84,36.83 143.38,36.83 144.65,38.1 148.46,38.1 | 148.46,38.1 v152.27,38.1 | E2.82 161.16,59.69 168.78,59.69 E2.72
  Bottom 0.813: v10.03,22.86 v22.73,22.86 v41.78,22.86 v51.94,22.86 v92.58,22.86 C35.- 121.79,8.89 U$1.CC2 | v244.98,22.86 C33.- 255.14,10.16 U$1.AC2 | v244.98,22.86 v225.93,22.86 | v225.93,22.86 v213.23,22.86 | v213.23,22.86 v195.45,22.86 | v134.49,22.86 143.38,22.86 | 143.38,22.86 v156.08,22.86 v159.89,22.86 v175.13,22.86 | U$1.BF2 175.13,8.89 v175.13,22.86 | v143.38,19.05 143.38,22.86 | U$1.BC2 185.29,8.89 C34.- v175.13,22.86 | U$1.AT1 213.55,8.57 213.23,8.89 v213.23,22.86 | U$1.AN1 226.25,8.57 225.93,8.89 v225.93,22.86 | U$1.AF1 245.3,8.57 244.98,8.89 v244.98,22.86 | SV2.10 187.83,48.26 v208.15,27.94 | SV2.2 225.93,119.38 SERIAL.6 236.09,187.96 TS_DISABLE.3 | E2.47 v159.89,26.67 | E2.7 149.73,66.04 153.54,66.04 C3.2 | SERIAL.1 213.23,139.7 OSC.4 161.16,90.17 C5.2 148.46,90.17 47.93,195.78 USB.G2 45.39,198.32 43.05,200.66 | USB.G1 25.27,203 25.27,203.2 40.51,203.2 43.05,200.66 | 43.05,200.66 39.09,196.7 USB.5 | TS_DISABLE.B1 TS_DISABLE.B
  pour Bottom: -0.13,19.05 -0.13,203.2 265.3,203.2 265.3,116.84 260.22,116.84 260.22,77.47 265.3,77.47 265.3,17.78
IND1_L  (via drill 0.81)
  Top 0.406: v76.07,19.05 76.07,22.86 104.01,50.8 E2.20
  Bottom 0.406: U$1.CU2 77.03,8.57 77.34,8.89 77.34,17.78 v76.07,19.05
IND2_L  (via drill 0.81)
  Top 0.406: v73.53,19.05 73.53,22.86 104.01,53.34 E2.18
  Bottom 0.406: U$1.CV2 73.85,9.84 73.53,10.16 v73.53,19.05
INITIALIZE
  Top 0.406: U$1.CR1 86.55,8.57 86.23,8.89 86.23,22.86 109.09,45.72 E2.24
INT_IN_PROGRESS_L  (via drill 0.81)
  Top 0.406: v152.27,19.05 152.27,22.86 161.16,31.75 161.16,34.29 E2.48
  Bottom 0.406: U$1.BP2 153.22,8.57 153.54,8.89 153.54,17.78 v152.27,19.05
INT_RQST_L
  Top 0.406: U$1.CP1 89.73,8.57 90.04,8.89 90.04,22.86 111.63,44.45 140.84,44.45 E2.25
INTERNAL_IO_L
  Top 0.406: U$1.CL1 99.25,8.57 98.93,8.89 98.93,19.05 120.52,40.64 E2.28
IO_PAUSE_L
  Top 0.406: U$1.CD1 118.3,8.57 117.98,8.89 117.98,21.59 125.6,29.21 144.65,29.21 145.92,30.48 145.92,34.29 E2.36
IR00_L  (via drill 0.81)
  Top 0.406: v48.13,19.05 48.13,22.86 79.88,54.61 140.84,54.61 E2.17
  Bottom 0.406: U$1.DD2 48.45,8.57 48.13,8.89 v48.13,19.05
IR01_L  (via drill 0.81)
  Top 0.406: v45.59,19.05 45.59,22.86 78.61,55.88 E2.16
  Bottom 0.406: U$1.DE2 45.28,9.84 45.59,10.16 v45.59,19.05
KEY_CTL_L  (via drill 0.81)
  Top 0.406: v6.22,19.05 6.22,22.86 59.56,76.2 154.81,76.2 162.43,68.58 E2.79
  Bottom 0.406: U$1.DU2 7.18,8.57 7.49,8.89 7.49,17.78 v6.22,19.05
LOAD_ADDR  (via drill 0.81)
  Top 0.406: v15.11,19.05 15.11,22.86 64.64,72.39 148.46,72.39 153.54,67.31 153.54,62.23 E2.2
  Bottom 0.406: U$1.DR2 16.7,8.57 16.38,8.89 16.38,17.78 v15.11,19.05
LOAD_CNTL  (via drill 0.81)
  Top 0.406: v172.59,19.05 172.59,33.02 E2.54
  Bottom 0.406: U$1.BH2 172.28,8.57 172.59,8.89 v172.59,19.05
MD00_L
  Top 0.406: U$1.AK1 235.78,8.57 236.09,8.89 236.09,25.4 209.42,52.07 168.78,52.07 E2.67
MD01_L
  Top 0.406: U$1.AL1 232.6,8.57 232.28,8.89 232.28,24.13 206.88,49.53 168.78,49.53 E2.65
MD02_L
  Top 0.406: U$1.AM1 229.43,8.57 229.74,8.89 229.74,21.59 203.07,48.26 E2.64
MD03_L
  Top 0.406: U$1.AP1 223.07,8.57 223.39,8.89 223.39,19.05 195.14,46.67 194.82,46.99 168.78,46.99 E2.63
MD04_L
  Top 0.406: U$1.BK1 165.93,8.57 166.24,8.89 166.24,34.29 E2.52
MD05_L
  Top 0.406: U$1.BL1 162.75,8.57 162.43,8.89 162.43,19.05 164.97,21.59 E2.51
MD06_L
  Top 0.406: U$1.BM1 159.57,8.57 159.89,8.89 159.89,19.05 163.7,22.86 163.7,34.29 E2.50
MD07_L
  Top 0.406: U$1.BP1 153.22,8.57 153.54,8.89 153.54,22.86 162.43,31.75 E2.49
MD08_L
  Top 0.406: U$1.DK1 32.58,8.57 32.89,8.89 32.89,22.86 70.99,60.96 E2.12
MD09_L
  Top 0.406: U$1.DL1 29.4,9.84 29.08,10.16 29.08,22.86 70.99,64.77 143.38,64.77 143.38,62.23 E2.10
MD10_L
  Top 0.406: U$1.DM1 26.23,8.57 26.54,8.89 26.54,22.86 69.72,66.04 143.38,66.04 144.65,64.77 E2.9
MD11_L
  Top 0.406: U$1.DP1 19.88,8.57 20.19,8.89 20.19,22.86 65.91,68.58 144.65,68.58 148.46,64.77 148.46,62.23 E2.6
POWER_OK  (via drill 0.81)
  Top 0.406: E2.39 149.73,30.48 145.92,26.67 142.11,26.67 v135.76,20.32
  Bottom 0.406: U$1.BV2 137.35,8.57 137.03,8.89 137.03,19.05 v135.76,20.32
RUN_L  (via drill 0.81)
  Top 0.406: v139.57,19.05 144.65,24.13 145.92,24.13 152.27,30.48 E2.41
  Bottom 0.406: U$1.BU2 140.53,11.11 140.84,11.43 140.84,17.78 v139.57,19.05
RXD
  Top 0.406: E2.75 167.51,69.85 43.05,194.31 35.43,194.31 33.04,196.7 USB.3
SKIP_L
  Top 0.406: U$1.CS1 83.69,8.89 83.69,22.86 109.09,48.26 E2.22
TCK2  (via drill 0.81)
  Top 0.406: E2.62 v181.48,45.72
  Bottom 0.406: v181.48,45.72 181.48,77.47 SV2.1
TDI2  (via drill 0.81)
  Top 0.406: v171.32,71.12 SV2.9
  Bottom 0.406: E2.14 138.3,59.69 138.3,62.23 147.19,71.12 v171.32,71.12
TDO2  (via drill 0.81)
  Top 0.406: E2.71 168.78,57.15 v182.75,57.15
  Bottom 0.406: v182.75,57.15 182.75,76.2 SV2.3
TMS2  (via drill 0.81)
  Top 0.406: v171.32,76.2 SV2.5
  Bottom 0.406: E2.23 140.84,49.53 138.3,49.53 137.03,50.8 137.03,63.5 149.73,76.2 v171.32,76.2
TP2  (via drill 0.81)
  Top 0.406: E2.34 143.38,34.29 143.38,31.75 125.6,31.75 114.17,20.32 v114.17,19.05
  Bottom 0.406: U$1.CE2 115.12,8.57 115.44,8.89 115.44,17.78 v114.17,19.05
TP3  (via drill 0.81)
  Top 0.406: E2.31 140.84,36.83 124.33,36.83 109.09,21.59 v109.09,19.05
  Bottom 0.406: U$1.CH2 108.78,8.57 109.09,8.89 v109.09,19.05
TP4  (via drill 0.81)
  Top 0.406: E2.30 124.33,38.1 v105.28,19.05
  Bottom 0.406: U$1.CJ2 105.6,8.57 105.28,8.89 v105.28,19.05
TP_AA1
  Top 0.406: U$1.AA1 261.18,8.57 261.49,8.89 261.49,27.94 228.47,60.96 E2.74 | SERIAL.10 RN2.4
  Bottom 0.406: E2.74 176.4,67.31 176.4,90.17 214.5,128.27 214.5,191.77 SERIAL.10
TP_AB1
  Top 0.406: U$1.AB1 258,8.57 257.68,8.89 257.68,26.67 224.66,59.69 168.78,59.69 E2.73 | SERIAL.9 RN2.5
  Bottom 0.406: SERIAL.9 217.04,191.77 217.04,128.27 177.67,88.9 177.67,62.23 172.59,57.15 168.78,57.15 E2.73
TP_BA1  (via drill 0.81)
  Top 0.406: U$1.BA1 191.32,8.57 191.64,8.89 191.64,17.78 v190.37,19.05 | v190.37,24.13 v176.4,38.1 E2.56 | SERIAL.8 RN2.6
  Bottom 0.406: v190.37,19.05 v190.37,24.13 | v176.4,38.1 178.94,40.64 178.94,87.63 219.58,128.27 219.58,191.77 SERIAL.8
TP_BB1  (via drill 0.81)
  Top 0.406: U$1.BB1 188.15,9.84 187.83,10.16 v187.83,19.05 | v187.83,24.13 187.83,25.4 176.4,36.83 v175.13,36.83 168.78,36.83 E2.55 | SERIAL.7 RN2.7
  Bottom 0.406: v187.83,19.05 v187.83,24.13 | SERIAL.7 222.12,191.77 222.12,128.27 180.21,86.36 180.21,39.37 177.67,36.83 v175.13,36.83
TS1_L  (via drill 0.81)
  Top 0.406: v102.74,19.05 123.06,39.37 140.84,39.37 E2.29
  Bottom 0.406: U$1.CK2 102.43,8.57 102.74,8.89 v102.74,19.05
TS3_L  (via drill 0.81)
  Top 0.406: v96.39,19.05 119.25,41.91 140.84,41.91 E2.27
  Bottom 0.406: U$1.CM2 96.08,8.57 96.39,8.89 v96.39,19.05
TXD
  Top 0.406: E2.76 166.24,62.23 166.24,69.85 43.05,193.04 34.16,193.04 30.5,196.7 USB.2
USER_MODE_L  (via drill 0.81)
  Top 0.406: v25.27,19.05 25.27,22.86 69.72,67.31 143.38,67.33 145.92,64.79 145.92,62.23 E2.8
  Bottom 0.406: U$1.DM2 26.54,7.62 26.54,17.78 v25.27,19.05
VCC  (via drill 0.81)
  Top 0.813: v125.6,34.29 VCCINT.1 | C35.+ VCCIO.1
  Bottom 0.813: 261.49,25.4 261.49,36.83 C33.+ 255.14,64.77 241.17,78.74 | 261.49,25.4 261.49,8.89 U$1.AA2 | U$1.BA2 191.64,8.89 191.64,25.4 | 191.64,25.4 261.49,25.4 | U$1.CA2 128.14,8.89 128.14,25.4 | 128.14,25.4 187.83,25.4 | 187.83,25.4 191.64,25.4 | 128.14,25.4 128.14,31.75 v125.6,34.29 121.79,38.1 C35.+ | C34.+ 187.83,40.64 187.83,25.4 | SV2.4 241.17,78.74 | C5.1 OSC.8 210.69,152.4 RN2.1 213.23,203.2 238.63,203.2 241.17,200.66 241.17,78.74
VCCINT
  Top 0.61: E2.3 152.27,64.77 149.73,67.31 C3.1
  Top 0.813: VCCINT.2 C1.1
  Bottom 0.61: E2.43 153.54,34.29 153.54,62.23 E2.3
  Bottom 0.813: C1.1 135.76,30.48 152.27,30.48 E2.43
VCCIO  (via drill 0.81)
  Top 0.61: C4.1 163.7,62.23 E2.78 v162.43,58.42 144.65,58.42 | C2.1 E2.53 | E2.38 147.19,39.37 v144.65,41.91 144.65,58.42 | E2.13 144.65,58.42
  Top 0.813: E2.26 VCCIO.2
  Bottom 0.61: v144.65,41.91 140.84,41.91 E2.26 | E2.66 168.78,52.07 166.24,52.07 162.43,55.88 v162.43,58.42
  Bottom 0.813: E2.66 172.59,49.53 172.59,35.56 170.05,33.02 E2.53

### Text on the board
Top: + | + | +
Bottom: SERIAL PORT CARD
tPlace: M837